# Altium schematic sheet GPS.SchDoc
size A4; SheetNumber: 4
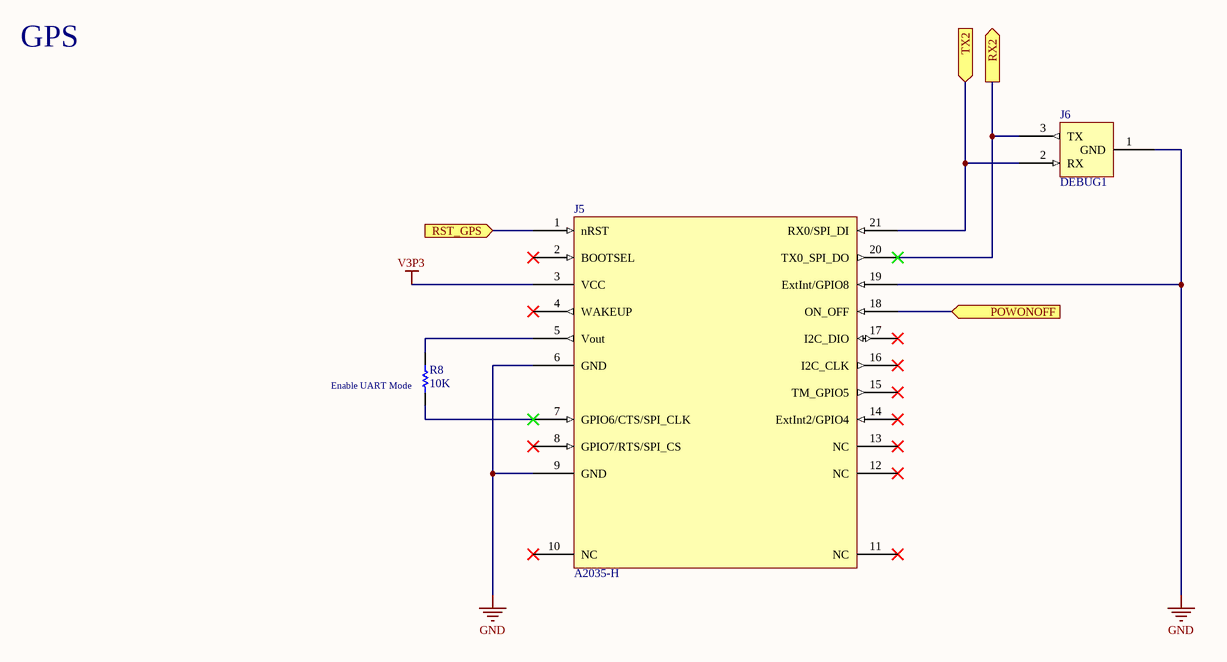
[diagram p0: GPS.SchDoc]

## Parts
J5  A2035-H  [A2035-H]
J6  DEBUG1  [DEBUG3]
R8  10K  [own_0603]

## Ports
POWONOFF (in), RST_GPS (in), RX2 (out), TX2 (in)

## Nets
GND: J5.6(GND) J5.9(GND) J5.19(ExtInt/GPIO8) J6.1(GND)
V3P3: J5.3(VCC)
POWONOFF: J5.18(ON_OFF) ; port POWONOFF
RST_GPS: J5.1(nRST) ; port RST_GPS
RX2: J5.20(TX0_SPI_DO) J6.3(TX) ; port RX2
TX2: J5.21(RX0/SPI_DI) J6.2(RX) ; port TX2
NetJ5_5: J5.5(Vout) R8.2
NetJ5_7: J5.7(GPIO6/CTS/SPI_CLK) R8.1

Not connected (* = marked no-connect by the designer): J5 2(BOOTSEL)* 4(WAKEUP)* 8(GPIO7/RTS/SPI_CS)* 10(NC)* 11(NC)* 12(NC)* 13(NC)* 14(ExtInt2/GPIO4)* 15(TM_GPIO5)* 16(I2C_CLK)* 17(I2C_DIO)*

## Notes on the sheet
- GPS
- (near R8) Enable UART Mode

## Library data of the parts
J5 = A2035-H: GPS Module; Fabricant: MAESTRO WIRELESS SOLUTIONS; RefFabricant: A2035H; Fournisseur: Farnell; RefFournisseur: 2281693
J6 = TTL_Debug_3: Debug interface
R8 = Res1: Resistor; Fournisseur: Farnell; Fabricant: PANASONIC ELECTRONIC COMPONENTS; RefFabricant: ERA3ARW103V; RefFournisseur: 1688472